# EAGLE schematic v0a (EAGLE 9.3.0)
CREVISION: v0a; DESIGNER: Rafael Silva

## Sheet 1 of 5: Main Controller
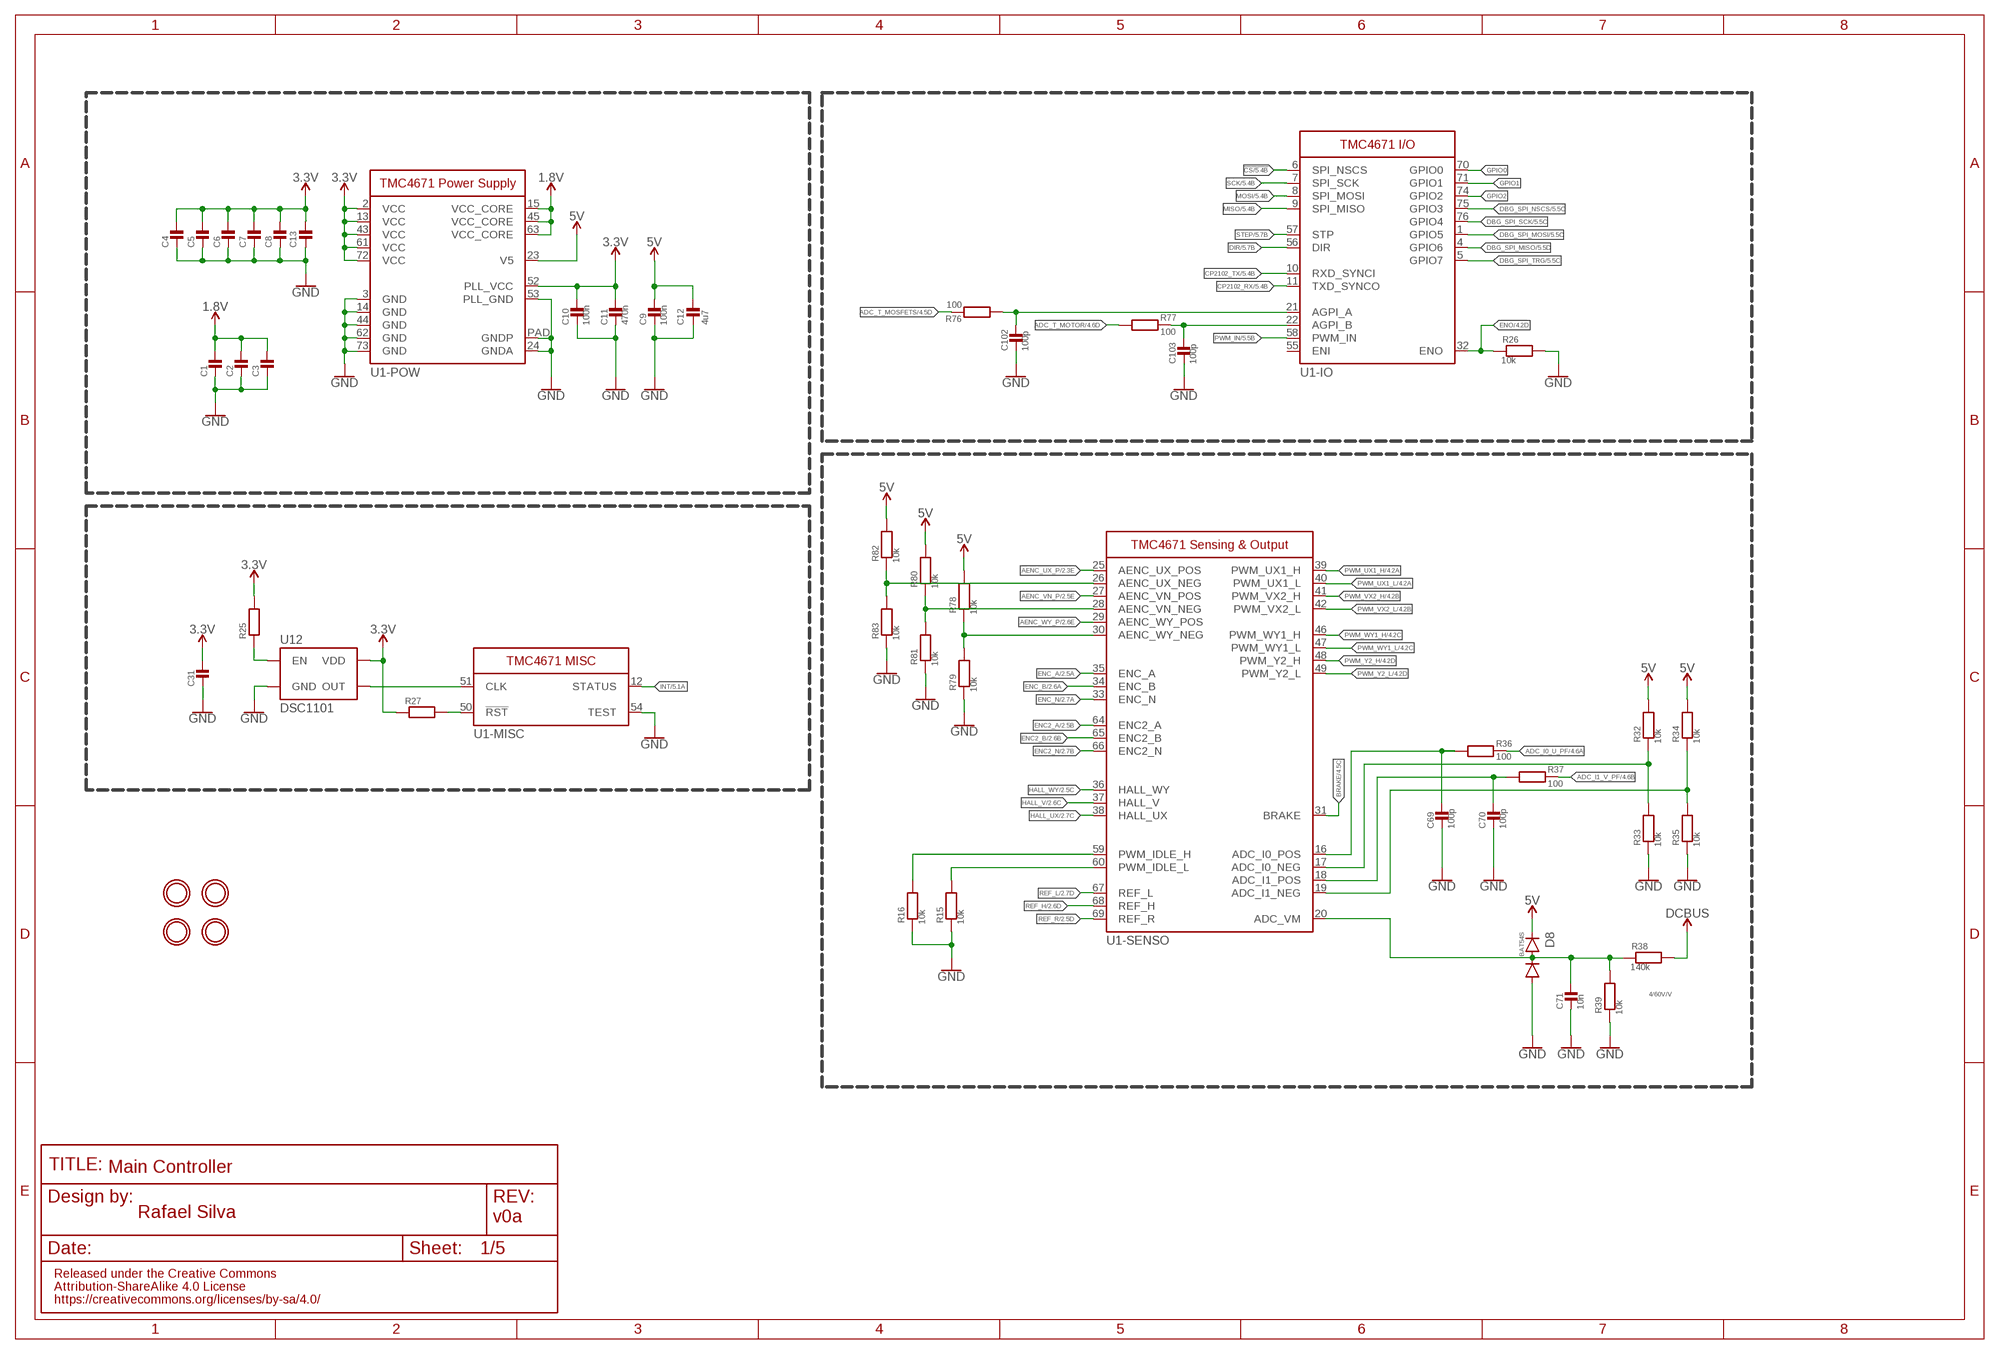
[diagram p0: schematic, sheet 1]

### Parts
C1  MLCC0603  [0603_WAVE]
C2  MLCC0603  [0603_WAVE]
C3  MLCC0603  [0603_WAVE]
C4  MLCC0603  [0603_WAVE]
C5  MLCC0603  [0603_WAVE]
C6  MLCC0603  [0603_WAVE]
C7  MLCC0603  [0603_WAVE]
C8  MLCC0603  [0603_WAVE]
C9  100n  MLCC0603  [0603_WAVE]
C10  100n  MLCC0603  [0603_WAVE]
C11  470n  MLCC0603  [0603_WAVE]
C12  4u7  MLCC0603  [0603_WAVE]
C13  MLCC0603  [0603_WAVE]
C31  MLCC0603  [0603_WAVE]
C69  100p  MLCC0603  [0603_WAVE]
C70  100p  MLCC0603  [0603_WAVE]
C71  10n  MLCC0603  [0603_WAVE]
C102  100p  MLCC0603  [0603_WAVE]
C103  100p  MLCC0603  [0603_WAVE]
D8  BAT54S  [SOT-23-3]
R15  10k  RESISTOR0603  [0603_WAVE]
R16  10k  RESISTOR0603  [0603_WAVE]
R25  RESISTOR0603  [0603_WAVE]
R26  10k  RESISTOR0603  [0603_WAVE]
R27  RESISTOR0603  [0603_WAVE]
R32  10k  RESISTOR0603  [0603_WAVE]
R33  10k  RESISTOR0603  [0603_WAVE]
R34  10k  RESISTOR0603  [0603_WAVE]
R35  10k  RESISTOR0603  [0603_WAVE]
R36  100  RESISTOR0603  [0603_WAVE]
R37  100  RESISTOR0603  [0603_WAVE]
R38  140k  RESISTOR0603  [0603_WAVE]
R39  10k  RESISTOR0603  [0603_WAVE]
R76  100  RESISTOR0603  [0603_WAVE]
R77  100  RESISTOR0603  [0603_WAVE]
R78  10k  RESISTOR0603  [0603_WAVE]
R79  10k  RESISTOR0603  [0603_WAVE]
R80  10k  RESISTOR0603  [0603_WAVE]
R81  10k  RESISTOR0603  [0603_WAVE]
R82  10k  RESISTOR0603  [0603_WAVE]
R83  10k  RESISTOR0603  [0603_WAVE]
U1  TMC4671  [QFN76]
U12  DSC1101  [CDFN_5X3.2]
U$12  MOUNTINGHOLE3.0  [MOUNTINGHOLE_3.0_PLATED]
U$13  MOUNTINGHOLE3.0  [MOUNTINGHOLE_3.0_PLATED]
U$15  MOUNTINGHOLE3.0  [MOUNTINGHOLE_3.0_PLATED]
U$16  MOUNTINGHOLE3.0  [MOUNTINGHOLE_3.0_PLATED]

### Nets
1.8V: C1.P$1 C2.P$1 C3.P$1 U1.15(-POW:VCC_CORE) U1.45(-POW:VCC_CORE) U1.63(-POW:VCC_CORE)
3.3V: C4.P$1 C5.P$1 C6.P$1 C7.P$1 C8.P$1 C10.P$1 C11.P$1 C13.P$1 C31.P$1 R25.P$2 R27.P$1 U1.2(-POW:VCC) U1.13(-POW:VCC) U1.43(-POW:VCC) U1.52(-POW:PLL_VCC) U1.61(-POW:VCC) U1.72(-POW:VCC) U12.6(VDD) ; also sheet 2,3,4,5
5V: C9.P$1 C12.P$1 D8.P$2 R32.P$2 R34.P$2 R78.P$2 R80.P$2 R82.P$2 U1.23(-POW:V5) ; also sheet 2,3,4
!CS: U1.6(-IO:SPI_NSCS) ; also sheet 5
ADC_I0_U_PF: R36.P$2 ; also sheet 4
ADC_I1_V_PF: R37.P$2 ; also sheet 4
ADC_T_MOSFETS: R76.P$2 ; also sheet 4
ADC_T_MOTOR: R77.P$1 ; also sheet 4
AENC_UX_P: U1.25(-SENSO:AENC_UX_POS) ; also sheet 2
AENC_VN_P: U1.27(-SENSO:AENC_VN_POS) ; also sheet 2
AENC_WY_P: U1.29(-SENSO:AENC_WY_POS) ; also sheet 2
BRAKE: U1.31(-SENSO:BRAKE) ; also sheet 4
CP2102_RX: U1.11(-IO:TXD_SYNCO) ; also sheet 5
CP2102_TX: U1.10(-IO:RXD_SYNCI) ; also sheet 5
DBG_SPI_MISO: U1.4(-IO:GPIO6) ; also sheet 5
DBG_SPI_MOSI: U1.1(-IO:GPIO5) ; also sheet 5
DBG_SPI_NSCS: U1.75(-IO:GPIO3) ; also sheet 5
DBG_SPI_SCK: U1.76(-IO:GPIO4) ; also sheet 5
DBG_SPI_TRG: U1.5(-IO:GPIO7) ; also sheet 5
DCBUS: R38.P$2 ; also sheet 3,4
DIR: U1.56(-IO:DIR) ; also sheet 5
ENC2_A: U1.64(-SENSO:ENC2_A) ; also sheet 2
ENC2_B: U1.65(-SENSO:ENC2_B) ; also sheet 2
ENC2_N: U1.66(-SENSO:ENC2_N) ; also sheet 2
ENC_A: U1.35(-SENSO:ENC_A) ; also sheet 2
ENC_B: U1.34(-SENSO:ENC_B) ; also sheet 2
ENC_N: U1.33(-SENSO:ENC_N) ; also sheet 2
ENO: R26.P$1 U1.32(-IO:ENO) ; also sheet 4
GND: C1.P$2 C2.P$2 C3.P$2 C4.P$2 C5.P$2 C6.P$2 C7.P$2 C8.P$2 C9.P$2 C10.P$2 C11.P$2 C12.P$2 C13.P$2 C31.P$2 C69.P$2 C70.P$2 C71.P$2 C102.P$2 C103.P$2 D8.P$1 R15.P$1 R16.P$1 R26.P$2 R33.P$1 R35.P$1 R39.P$1 R79.P$1 R81.P$1 R83.P$1 U1.3(-POW:GND) U1.14(-POW:GND) U1.24(-POW:GNDA) U1.44(-POW:GND) U1.53(-POW:PLL_GND) U1.54(-MISC:TEST) U1.62(-POW:GND) U1.73(-POW:GND) U1.PAD(-POW:GNDP) U12.3(GND) ; also sheet 2,3,4,5
GPIO0: U1.70(-IO:GPIO0)
GPIO1: U1.71(-IO:GPIO1)
GPIO2: U1.74(-IO:GPIO2)
HALL_UX: U1.38(-SENSO:HALL_UX) ; also sheet 2
HALL_V: U1.37(-SENSO:HALL_V) ; also sheet 2
HALL_WY: U1.36(-SENSO:HALL_WY) ; also sheet 2
INT: U1.12(-MISC:STATUS) ; also sheet 5
MISO: U1.9(-IO:SPI_MISO) ; also sheet 5
MOSI: U1.8(-IO:SPI_MOSI) ; also sheet 5
N$38: R15.P$2 U1.60(-SENSO:PWM_IDLE_L)
N$39: R16.P$2 U1.59(-SENSO:PWM_IDLE_H)
N$41: U1.51(-MISC:CLK) U12.4(OUT)
N$42: R27.P$2 U1.50(-MISC:!RST!)
N$44: R25.P$1 U12.1(EN)
N$50: C69.P$1 R36.P$1 U1.16(-SENSO:ADC_I0_POS)
N$51: C70.P$1 R37.P$1 U1.18(-SENSO:ADC_I1_POS)
N$52: R32.P$1 R33.P$2 U1.17(-SENSO:ADC_I0_NEG)
N$53: R34.P$1 R35.P$2 U1.19(-SENSO:ADC_I1_NEG)
N$54: C71.P$1 D8.P$3 R38.P$1 R39.P$2 U1.20(-SENSO:ADC_VM)
N$92: C102.P$1 R76.P$1 U1.21(-IO:AGPI_A)
N$93: C103.P$1 R77.P$2 U1.22(-IO:AGPI_B)
N$94: R78.P$1 R79.P$2 U1.30(-SENSO:AENC_WY_NEG)
N$95: R80.P$1 R81.P$2 U1.28(-SENSO:AENC_VN_NEG)
N$96: R82.P$1 R83.P$2 U1.26(-SENSO:AENC_UX_NEG)
PWM_IN: U1.58(-IO:PWM_IN) ; also sheet 5
PWM_UX1_H: U1.39(-SENSO:PWM_UX1_H) ; also sheet 4
PWM_UX1_L: U1.40(-SENSO:PWM_UX1_L) ; also sheet 4
PWM_VX2_H: U1.41(-SENSO:PWM_VX2_H) ; also sheet 4
PWM_VX2_L: U1.42(-SENSO:PWM_VX2_L) ; also sheet 4
PWM_WY1_H: U1.46(-SENSO:PWM_WY1_H) ; also sheet 4
PWM_WY1_L: U1.47(-SENSO:PWM_WY1_L) ; also sheet 4
PWM_Y2_H: U1.48(-SENSO:PWM_Y2_H) ; also sheet 4
PWM_Y2_L: U1.49(-SENSO:PWM_Y2_L) ; also sheet 4
REF_H: U1.68(-SENSO:REF_H) ; also sheet 2
REF_L: U1.67(-SENSO:REF_L) ; also sheet 2
REF_R: U1.69(-SENSO:REF_R) ; also sheet 2
SCK: U1.7(-IO:SPI_SCK) ; also sheet 5
STEP: U1.57(-IO:STP) ; also sheet 5
Unconnected: U1.55(-IO:ENI)

### Notes on the sheet
- 4/60V/V
- Main Controller

## Sheet 2 of 5: Feedback
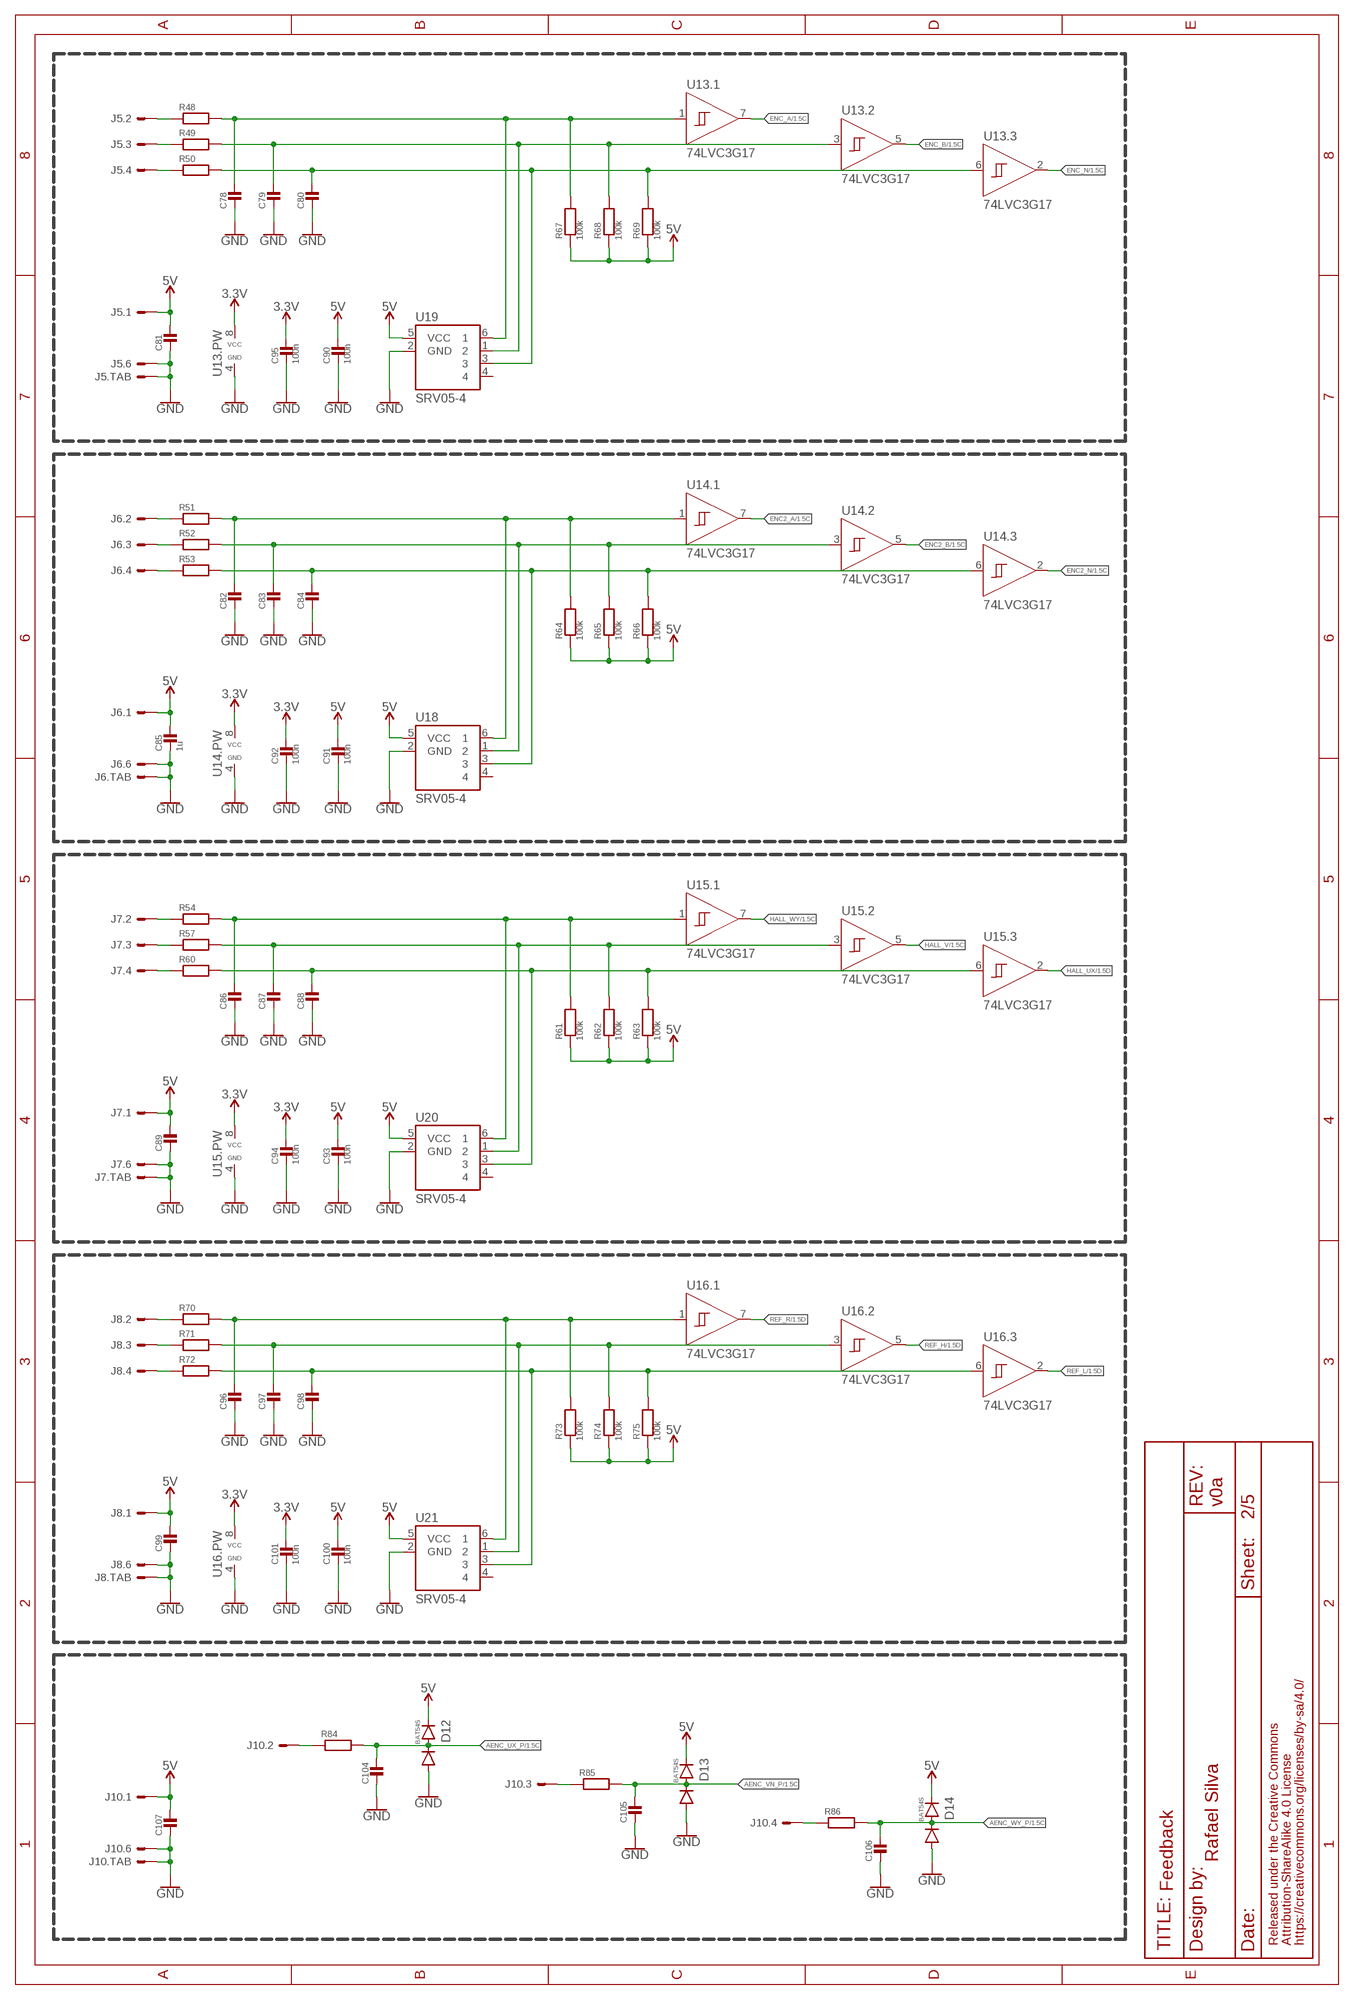
[diagram p1: schematic, sheet 2]

### Parts
C78  MLCC0603  [0603_WAVE]
C79  MLCC0603  [0603_WAVE]
C80  MLCC0603  [0603_WAVE]
C81  MLCC0603  [0603_WAVE]
C82  MLCC0603  [0603_WAVE]
C83  MLCC0603  [0603_WAVE]
C84  MLCC0603  [0603_WAVE]
C85  1u  MLCC0603  [0603_WAVE]
C86  MLCC0603  [0603_WAVE]
C87  MLCC0603  [0603_WAVE]
C88  MLCC0603  [0603_WAVE]
C89  MLCC0603  [0603_WAVE]
C90  100n  MLCC0603  [0603_WAVE]
C91  100n  MLCC0603  [0603_WAVE]
C92  100n  MLCC0603  [0603_WAVE]
C93  100n  MLCC0603  [0603_WAVE]
C94  100n  MLCC0603  [0603_WAVE]
C95  100n  MLCC0603  [0603_WAVE]
C96  MLCC0603  [0603_WAVE]
C97  MLCC0603  [0603_WAVE]
C98  MLCC0603  [0603_WAVE]
C99  MLCC0603  [0603_WAVE]
C100  100n  MLCC0603  [0603_WAVE]
C101  100n  MLCC0603  [0603_WAVE]
C104  MLCC0603  [0603_WAVE]
C105  MLCC0603  [0603_WAVE]
C106  MLCC0603  [0603_WAVE]
C107  MLCC0603  [0603_WAVE]
D12  BAT54S  [SOT-23-3]
D13  BAT54S  [SOT-23-3]
D14  BAT54S  [SOT-23-3]
J5  SH-5  [SM05B-SSR-H-TB]
J6  SH-5  [SM05B-SSR-H-TB]
J7  SH-5  [SM05B-SSR-H-TB]
J8  SH-5  [SM05B-SSR-H-TB]
J10  SH-5  [SM05B-SSR-H-TB]
R48  RESISTOR0603  [0603_WAVE]
R49  RESISTOR0603  [0603_WAVE]
R50  RESISTOR0603  [0603_WAVE]
R51  RESISTOR0603  [0603_WAVE]
R52  RESISTOR0603  [0603_WAVE]
R53  RESISTOR0603  [0603_WAVE]
R54  RESISTOR0603  [0603_WAVE]
R57  RESISTOR0603  [0603_WAVE]
R60  RESISTOR0603  [0603_WAVE]
R61  100k  RESISTOR0603  [0603_WAVE]
R62  100k  RESISTOR0603  [0603_WAVE]
R63  100k  RESISTOR0603  [0603_WAVE]
R64  100k  RESISTOR0603  [0603_WAVE]
R65  100k  RESISTOR0603  [0603_WAVE]
R66  100k  RESISTOR0603  [0603_WAVE]
R67  100k  RESISTOR0603  [0603_WAVE]
R68  100k  RESISTOR0603  [0603_WAVE]
R69  100k  RESISTOR0603  [0603_WAVE]
R70  RESISTOR0603  [0603_WAVE]
R71  RESISTOR0603  [0603_WAVE]
R72  RESISTOR0603  [0603_WAVE]
R73  100k  RESISTOR0603  [0603_WAVE]
R74  100k  RESISTOR0603  [0603_WAVE]
R75  100k  RESISTOR0603  [0603_WAVE]
R84  RESISTOR0603  [0603_WAVE]
R85  RESISTOR0603  [0603_WAVE]
R86  RESISTOR0603  [0603_WAVE]
U13  74LVC3G17  [TSSOP-8]
U14  74LVC3G17  [TSSOP-8]
U15  74LVC3G17  [TSSOP-8]
U16  74LVC3G17  [TSSOP-8]
U18  SRV05-4  [SOT23-6]
U19  SRV05-4  [SOT23-6]
U20  SRV05-4  [SOT23-6]
U21  SRV05-4  [SOT23-6]

### Nets
3.3V: C92.P$1 C94.P$1 C95.P$1 C101.P$1 U13.8(.PW:VCC) U14.8(.PW:VCC) U15.8(.PW:VCC) U16.8(.PW:VCC) ; also sheet 1,3,4,5
5V: C81.P$1 C85.P$1 C89.P$1 C90.P$1 C91.P$1 C93.P$1 C99.P$1 C100.P$1 C107.P$1 D12.P$2 D13.P$2 D14.P$2 J5.1 J6.1 J7.1 J8.1 J10.1 R61.P$1 R62.P$1 R63.P$1 R64.P$1 R65.P$1 R66.P$1 R67.P$1 R68.P$1 R69.P$1 R73.P$1 R74.P$1 R75.P$1 U18.5(VCC) U19.5(VCC) U20.5(VCC) U21.5(VCC) ; also sheet 1,3,4
AENC_UX_P: C104.P$1 D12.P$3 R84.P$2 ; also sheet 1
AENC_VN_P: C105.P$1 D13.P$3 R85.P$2 ; also sheet 1
AENC_WY_P: C106.P$1 D14.P$3 R86.P$2 ; also sheet 1
ENC2_A: U14.7(.1:Y) ; also sheet 1
ENC2_B: U14.5(.2:Y) ; also sheet 1
ENC2_N: U14.2(.3:Y) ; also sheet 1
ENC_A: U13.7(.1:Y) ; also sheet 1
ENC_B: U13.5(.2:Y) ; also sheet 1
ENC_N: U13.2(.3:Y) ; also sheet 1
GND: C78.P$2 C79.P$2 C80.P$2 C81.P$2 C82.P$2 C83.P$2 C84.P$2 C85.P$2 C86.P$2 C87.P$2 C88.P$2 C89.P$2 C90.P$2 C91.P$2 C92.P$2 C93.P$2 C94.P$2 C95.P$2 C96.P$2 C97.P$2 C98.P$2 C99.P$2 C100.P$2 C101.P$2 C104.P$2 C105.P$2 C106.P$2 C107.P$2 D12.P$1 D13.P$1 D14.P$1 J5.5 J5.FIT@1 J5.FIT@2 J6.5 J6.FIT@1 J6.FIT@2 J7.5 J7.FIT@1 J7.FIT@2 J8.5 J8.FIT@1 J8.FIT@2 J10.5 J10.FIT@1 J10.FIT@2 U13.4(.PW:GND) U14.4(.PW:GND) U15.4(.PW:GND) U16.4(.PW:GND) U18.2(GND) U19.2(GND) U20.2(GND) U21.2(GND) ; also sheet 1,3,4,5
HALL_UX: U15.2(.3:Y) ; also sheet 1
HALL_V: U15.5(.2:Y) ; also sheet 1
HALL_WY: U15.7(.1:Y) ; also sheet 1
N$67: C80.P$1 R50.P$2 R69.P$2 U13.6(.3:A) U19.3
N$69: C79.P$1 R49.P$2 R68.P$2 U13.3(.2:A) U19.1
N$70: C84.P$1 R53.P$2 R66.P$2 U14.6(.3:A) U18.3
N$71: J5.2 R48.P$1
N$72: J5.3 R49.P$1
N$73: J5.4 R50.P$1
N$74: C78.P$1 R48.P$2 R67.P$2 U13.1(.1:A) U19.6
N$75: C83.P$1 R52.P$2 R65.P$2 U14.3(.2:A) U18.1
N$76: J6.2 R51.P$1
N$77: J6.3 R52.P$1
N$78: J6.4 R53.P$1
N$79: C82.P$1 R51.P$2 R64.P$2 U14.1(.1:A) U18.6
N$80: C88.P$1 R60.P$2 R63.P$2 U15.6(.3:A) U20.3
N$81: C87.P$1 R57.P$2 R62.P$2 U15.3(.2:A) U20.1
N$82: J7.2 R54.P$1
N$83: J7.3 R57.P$1
N$84: J7.4 R60.P$1
N$85: C86.P$1 R54.P$2 R61.P$2 U15.1(.1:A) U20.6
N$86: C98.P$1 R72.P$2 R75.P$2 U16.6(.3:A) U21.3
N$87: C97.P$1 R71.P$2 R74.P$2 U16.3(.2:A) U21.1
N$88: J8.2 R70.P$1
N$89: J8.3 R71.P$1
N$90: J8.4 R72.P$1
N$91: C96.P$1 R70.P$2 R73.P$2 U16.1(.1:A) U21.6
N$97: J10.4 R86.P$1
N$98: J10.3 R85.P$1
N$99: J10.2 R84.P$1
REF_H: U16.5(.2:Y) ; also sheet 1
REF_L: U16.2(.3:Y) ; also sheet 1
REF_R: U16.7(.1:Y) ; also sheet 1
Unconnected: U18.4 U19.4 U20.4 U21.4

### Notes on the sheet
- Feedback

## Sheet 3 of 5: Power Management
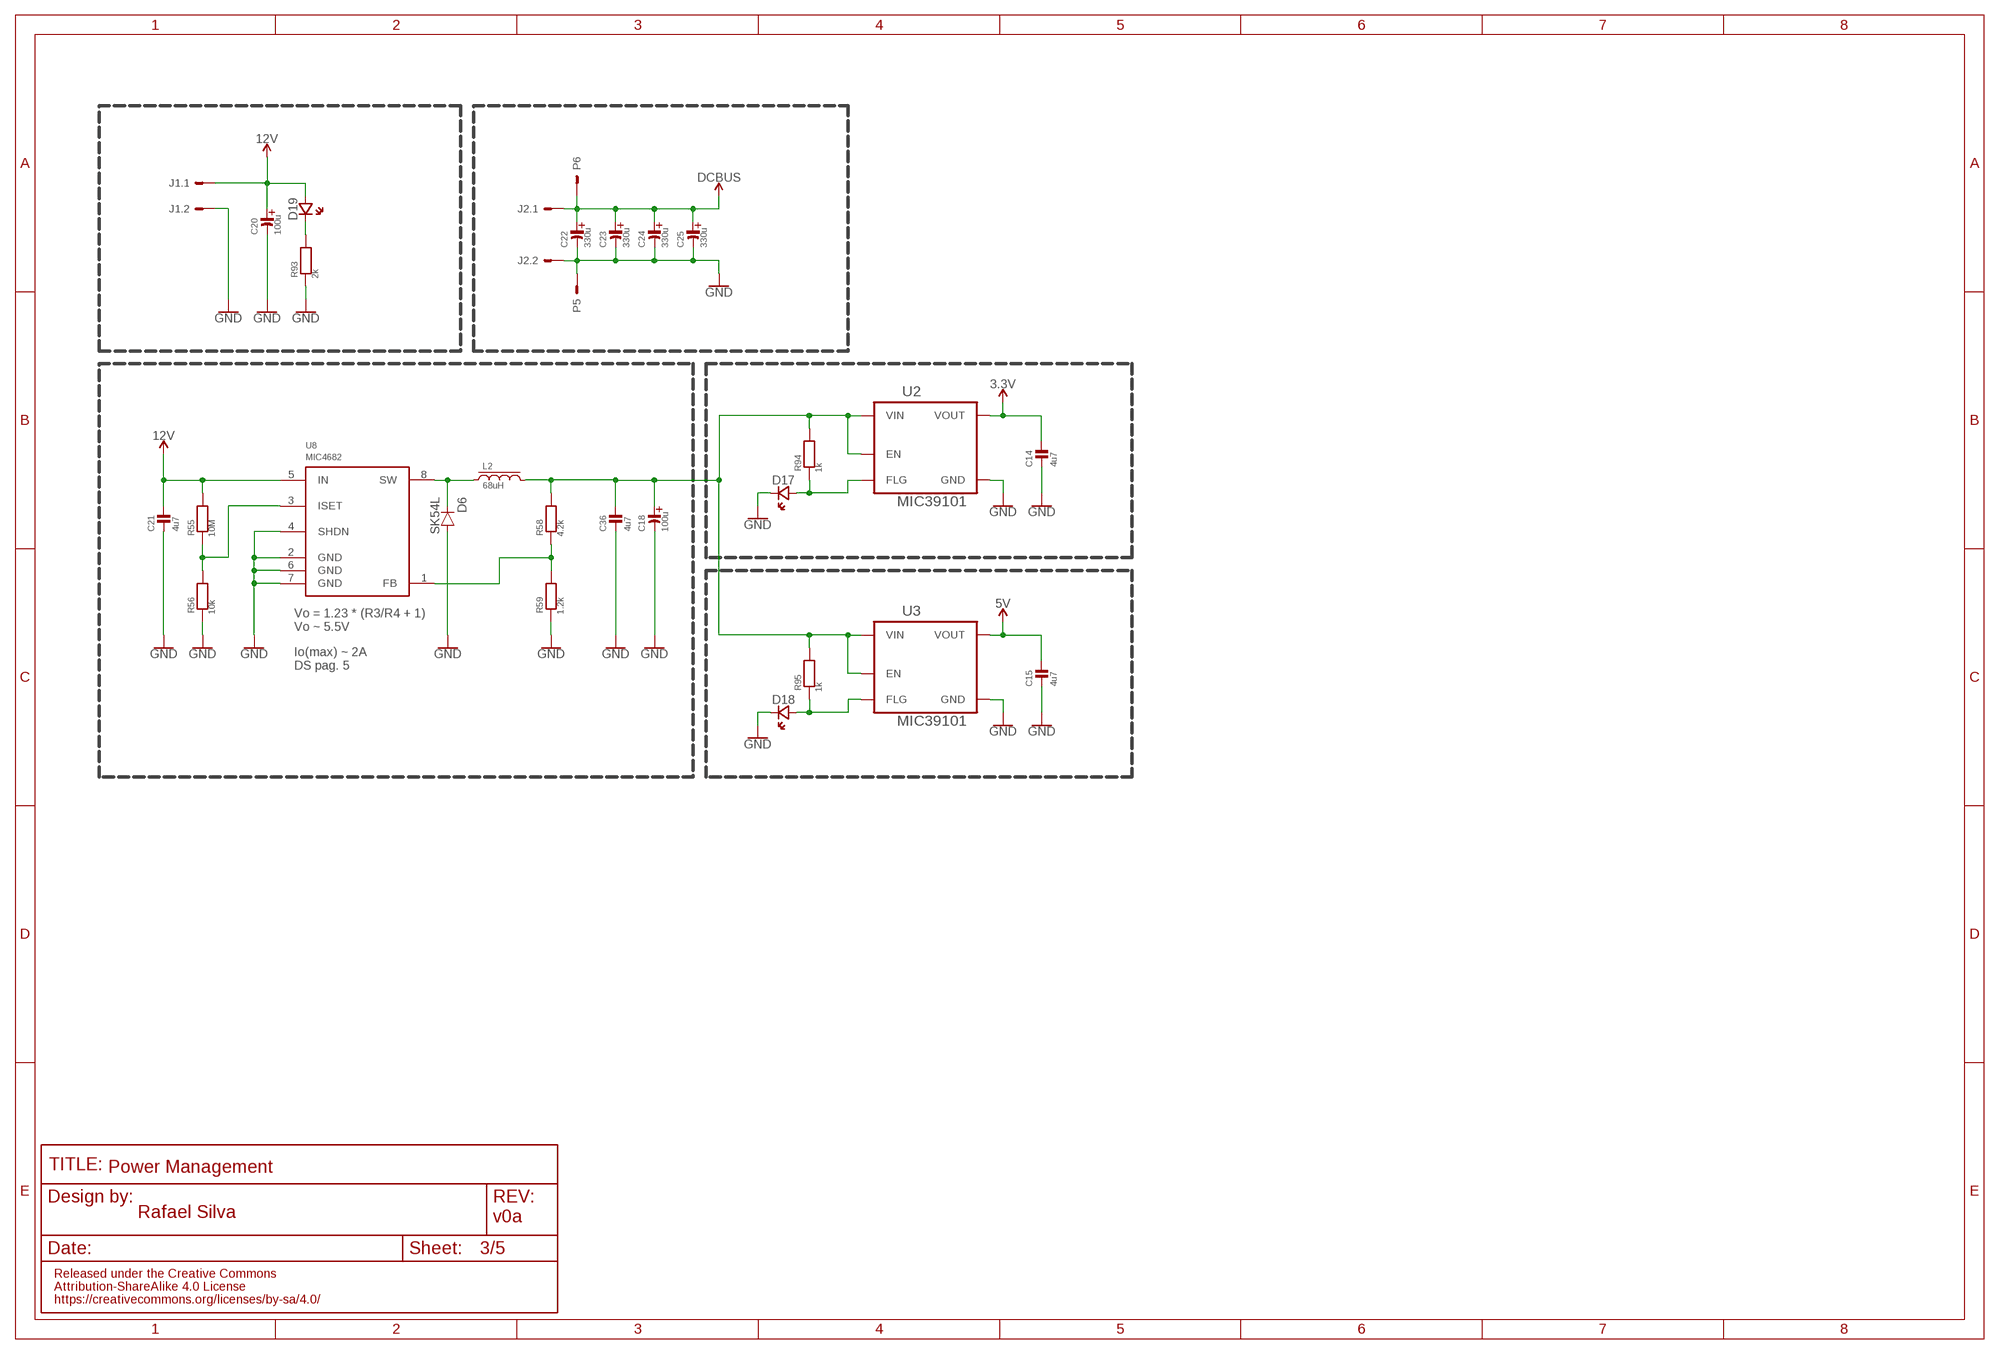
[diagram p2: schematic, sheet 3]

### Parts
C14  4u7  MLCC0603  [0603_WAVE]
C15  4u7  MLCC0603  [0603_WAVE]
C18  100u  CAPACITOR_ELD  [PANASONIC_D]
C20  100u  CAPACITOR_ELD  [PANASONIC_D]
C21  4u7  MLCC0603  [0603_WAVE]
C22  330u  CAPACITOR_ELG  [PANASONIC_G]
C23  330u  CAPACITOR_ELG  [PANASONIC_G]
C24  330u  CAPACITOR_ELG  [PANASONIC_G]
C25  330u  CAPACITOR_ELG  [PANASONIC_G]
C36  4u7  MLCC0603  [0603_WAVE]
D6  SK54L  [DO214AA]
D17  LED0603  [CHIPLED_0603]
D18  LED0603  [CHIPLED_0603]
D19  LED0603  [CHIPLED_0603]
J1  2P-6.35P  [2P-6.35P]
J2  2P-6.35P  [2P-6.35P]
L2  68uH  INDUCTORCDRH104R  [CDRH104R]
P5  POWPAD  [TH-HP]
P6  POWPAD  [TH-HP]
R55  10M  RESISTOR0603  [0603_WAVE]
R56  10k  RESISTOR0603  [0603_WAVE]
R58  4.2k  RESISTOR0603  [0603_WAVE]
R59  1.2k  RESISTOR0603  [0603_WAVE]
R93  2k  RESISTOR0603  [0603_WAVE]
R94  1k  RESISTOR0603  [0603_WAVE]
R95  1k  RESISTOR0603  [0603_WAVE]
U2  MIC39101  [SOIC8]
U3  MIC39101  [SOIC8]
U8  MIC4682  [SOIC8]

### Nets
3.3V: C14.P$1 U2.3(VOUT) ; also sheet 1,2,4,5
5V: C15.P$1 U3.3(VOUT) ; also sheet 1,2,4
12V: C20.+(AN) C21.P$1 D19.A(AN) J1.1 R55.P$2 U8.5(IN) ; also sheet 4
DCBUS: C22.+(AN) C23.+(AN) C24.+(AN) C25.+(AN) J2.1 P6.H1(S) P6.H2(S) P6.H3(S) P6.H4(S) P6.H5(S) P6.H6(S) P6.H7(S) P6.H8(S) P6.H9(S) P6.H10(S) P6.H11(S) P6.H12(S) P6.PAD(S) ; also sheet 1,4
GND: C14.P$2 C15.P$2 C18.-(CA) C20.-(CA) C21.P$2 C22.-(CA) C23.-(CA) C24.-(CA) C25.-(CA) C36.P$2 D6.A D17.C(CA) D18.C(CA) J1.2 J2.2 P5.H1(S) P5.H2(S) P5.H3(S) P5.H4(S) P5.H5(S) P5.H6(S) P5.H7(S) P5.H8(S) P5.H9(S) P5.H10(S) P5.H11(S) P5.H12(S) P5.PAD(S) R56.P$1 R59.P$1 R93.P$1 U2.5(GND) U2.6(GND) U2.7(GND) U2.8(GND) U3.5(GND) U3.6(GND) U3.7(GND) U3.8(GND) U8.2(GND) U8.4(SHDN) U8.6(GND) U8.7(GND) ; also sheet 1,2,4,5
N$5: C18.+(AN) C36.P$1 L2.2 R58.P$2 R94.P$2 R95.P$2 U2.1(EN) U2.2(VIN) U3.1(EN) U3.2(VIN)
N$45: D6.C L2.1 U8.8(SW)
N$46: R58.P$1 R59.P$2 U8.1(FB)
N$47: R55.P$1 R56.P$2 U8.3(ISET)
N$60: D17.A(AN) R94.P$1 U2.4(FLG)
N$62: D19.C(CA) R93.P$2
N$104: D18.A(AN) R95.P$1 U3.4(FLG)

### Notes on the sheet
- Vo = 1.23 * (R3/R4 + 1)
  Vo ~ 5.5V
- Io(max) ~ 2A
  DS pag. 5
- Power Management

## Sheet 4 of 5: Power Stage
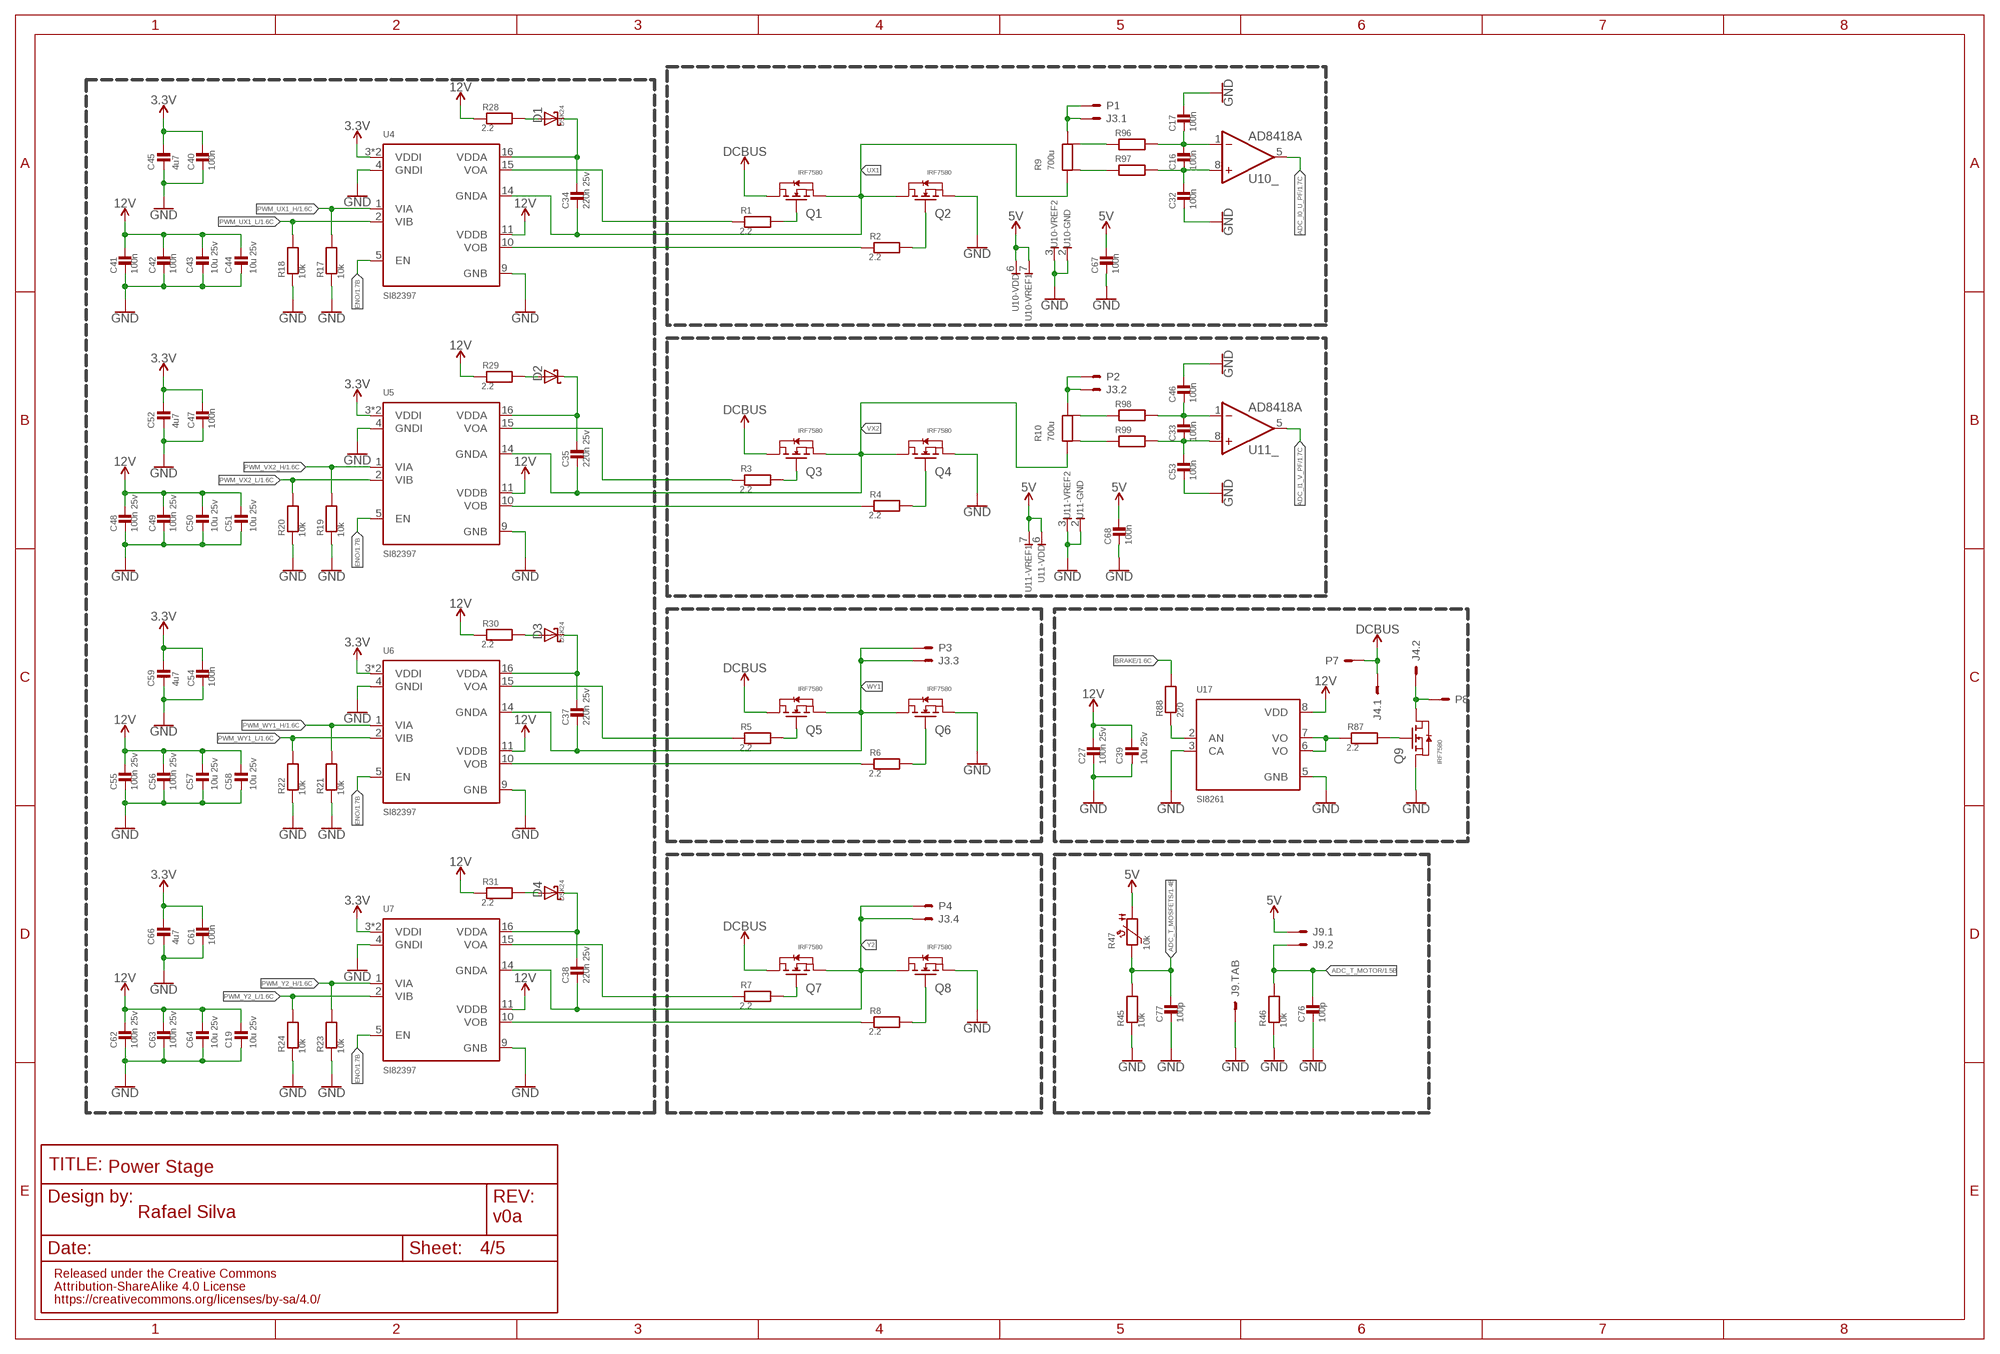
[diagram p3: schematic, sheet 4]

### Parts
C16  100n  MLCC0603  [0603_WAVE]
C17  100n  MLCC0603  [0603_WAVE]
C19  10u 25v  MLCC0603  [0603_WAVE]
C27  100n 25v  MLCC0603  [0603_WAVE]
C32  100n  MLCC0603  [0603_WAVE]
C33  100n  MLCC0603  [0603_WAVE]
C34  220n 25v  MLCC0603  [0603_WAVE]
C35  220n 25v  MLCC0603  [0603_WAVE]
C37  220n 25v  MLCC0603  [0603_WAVE]
C38  220n 25v  MLCC0603  [0603_WAVE]
C39  10u 25v  MLCC0603  [0603_WAVE]
C40  100n  MLCC0603  [0603_WAVE]
C41  100n  MLCC0603  [0603_WAVE]
C42  100n  MLCC0603  [0603_WAVE]
C43  10u 25v  MLCC0603  [0603_WAVE]
C44  10u 25v  MLCC0603  [0603_WAVE]
C45  4u7  MLCC0603  [0603_WAVE]
C46  100n  MLCC0603  [0603_WAVE]
C47  100n  MLCC0603  [0603_WAVE]
C48  100n 25v  MLCC0603  [0603_WAVE]
C49  100n 25v  MLCC0603  [0603_WAVE]
C50  10u 25v  MLCC0603  [0603_WAVE]
C51  10u 25v  MLCC0603  [0603_WAVE]
C52  4u7  MLCC0603  [0603_WAVE]
C53  100n  MLCC0603  [0603_WAVE]
C54  100n  MLCC0603  [0603_WAVE]
C55  100n 25v  MLCC0603  [0603_WAVE]
C56  100n 25v  MLCC0603  [0603_WAVE]
C57  10u 25v  MLCC0603  [0603_WAVE]
C58  10u 25v  MLCC0603  [0603_WAVE]
C59  4u7  MLCC0603  [0603_WAVE]
C61  100n  MLCC0603  [0603_WAVE]
C62  100n 25v  MLCC0603  [0603_WAVE]
C63  100n 25v  MLCC0603  [0603_WAVE]
C64  10u 25v  MLCC0603  [0603_WAVE]
C66  4u7  MLCC0603  [0603_WAVE]
C67  100n  MLCC0603  [0603_WAVE]
C68  100n  MLCC0603  [0603_WAVE]
C76  100p  MLCC0603  [0603_WAVE]
C77  100p  MLCC0603  [0603_WAVE]
D1  DSK24  [SOD-123]
D2  DSK24  [SOD-123]
D3  DSK24  [SOD-123]
D4  DSK24  [SOD-123]
J3  4P-6.35P  [4P-6.35P]
J4  2P-6.35P  [2P-6.35P]
J9  SH-2  [SM02B-SSR-H-TB]
P1  POWPAD  [TH-HP]
P2  POWPAD  [TH-HP]
P3  POWPAD  [TH-HP]
P4  POWPAD  [TH-HP]
P7  POWPAD  [TH-HP]
P8  POWPAD  [TH-HP]
Q1  IRF7580  [DIRECTFET-ME]
Q2  IRF7580  [DIRECTFET-ME]
Q3  IRF7580  [DIRECTFET-ME]
Q4  IRF7580  [DIRECTFET-ME]
Q5  IRF7580  [DIRECTFET-ME]
Q6  IRF7580  [DIRECTFET-ME]
Q7  IRF7580  [DIRECTFET-ME]
Q8  IRF7580  [DIRECTFET-ME]
Q9  IRF7580  [DIRECTFET-ME]
R1  2.2  RESISTOR0603  [0603_WAVE]
R2  2.2  RESISTOR0603  [0603_WAVE]
R3  2.2  RESISTOR0603  [0603_WAVE]
R4  2.2  RESISTOR0603  [0603_WAVE]
R5  2.2  RESISTOR0603  [0603_WAVE]
R6  2.2  RESISTOR0603  [0603_WAVE]
R7  2.2  RESISTOR0603  [0603_WAVE]
R8  2.2  RESISTOR0603  [0603_WAVE]
R9  700u  LRMAP3920  [3920]
R10  700u  LRMAP3920  [3920]
R17  10k  RESISTOR0603  [0603_WAVE]
R18  10k  RESISTOR0603  [0603_WAVE]
R19  10k  RESISTOR0603  [0603_WAVE]
R20  10k  RESISTOR0603  [0603_WAVE]
R21  10k  RESISTOR0603  [0603_WAVE]
R22  10k  RESISTOR0603  [0603_WAVE]
R23  10k  RESISTOR0603  [0603_WAVE]
R24  10k  RESISTOR0603  [0603_WAVE]
R28  2.2  RESISTOR0603  [0603_WAVE]
R29  2.2  RESISTOR0603  [0603_WAVE]
R30  2.2  RESISTOR0603  [0603_WAVE]
R31  2.2  RESISTOR0603  [0603_WAVE]
R45  10k  RESISTOR0603  [0603_WAVE]
R46  10k  RESISTOR0603  [0603_WAVE]
R47  10k  NTC0603  [0603_WAVE]
R87  2.2  RESISTOR0603  [0603_WAVE]
R88  220  RESISTOR0603  [0603_WAVE]
R96  RESISTOR0603  [0603_WAVE]
R97  RESISTOR0603  [0603_WAVE]
R98  RESISTOR0603  [0603_WAVE]
R99  RESISTOR0603  [0603_WAVE]
U4  SI82397  [SOIC-16-WB]
U5  SI82397  [SOIC-16-WB]
U6  SI82397  [SOIC-16-WB]
U7  SI82397  [SOIC-16-WB]
U10  AD8418A  [MSOP-8]
U11  AD8418A  [MSOP-8]
U17  SI8261  [SOIC_8]

### Nets
3.3V: C40.P$1 C45.P$1 C47.P$1 C52.P$1 C54.P$1 C59.P$1 C61.P$1 C66.P$1 U4.3(VDDI) U4.8(VDDI) U5.3(VDDI) U5.8(VDDI) U6.3(VDDI) U6.8(VDDI) U7.3(VDDI) U7.8(VDDI) ; also sheet 1,2,3,5
5V: C67.P$1 C68.P$1 J9.1 R47.P$2 U10.6 U10.7 U11.6 U11.7 ; also sheet 1,2,3
12V: C19.P$1 C27.P$1 C39.P$1 C41.P$1 C42.P$1 C43.P$1 C44.P$1 C48.P$1 C49.P$1 C50.P$1 C51.P$1 C55.P$1 C56.P$1 C57.P$1 C58.P$1 C62.P$1 C63.P$1 C64.P$1 R28.P$1 R29.P$1 R30.P$1 R31.P$1 U4.11(VDDB) U5.11(VDDB) U6.11(VDDB) U7.11(VDDB) U17.8(VDD) ; also sheet 3
ADC_I0_U_PF: U10.5(_:O) ; also sheet 1
ADC_I1_V_PF: U11.5(_:O) ; also sheet 1
ADC_T_MOSFETS: C77.P$1 R45.P$2 R47.P$1 ; also sheet 1
ADC_T_MOTOR: C76.P$1 J9.2 R46.P$2 ; also sheet 1
BRAKE: R88.P$2 ; also sheet 1
DCBUS: J4.1 P7.H1(S) P7.H2(S) P7.H3(S) P7.H4(S) P7.H5(S) P7.H6(S) P7.H7(S) P7.H8(S) P7.H9(S) P7.H10(S) P7.H11(S) P7.H12(S) P7.PAD(S) Q1.D1 Q1.D2(D1) Q1.D3(D1) Q1.D4(D1) Q3.D1 Q3.D2(D1) Q3.D3(D1) Q3.D4(D1) Q5.D1 Q5.D2(D1) Q5.D3(D1) Q5.D4(D1) Q7.D1 Q7.D2(D1) Q7.D3(D1) Q7.D4(D1) ; also sheet 1,3
ENO: U4.5(EN) U5.5(EN) U6.5(EN) U7.5(EN) ; also sheet 1
GND: C17.P$1 C19.P$2 C27.P$2 C32.P$2 C39.P$2 C40.P$2 C41.P$2 C42.P$2 C43.P$2 C44.P$2 C45.P$2 C46.P$1 C47.P$2 C48.P$2 C49.P$2 C50.P$2 C51.P$2 C52.P$2 C53.P$2 C54.P$2 C55.P$2 C56.P$2 C57.P$2 C58.P$2 C59.P$2 C61.P$2 C62.P$2 C63.P$2 C64.P$2 C66.P$2 C67.P$2 C68.P$2 C76.P$2 C77.P$2 J9.FIT@1 J9.FIT@2 Q2.S1 Q2.S2(S1) Q2.S3(S1) Q2.S4(S1) Q2.S5(S1) Q4.S1 Q4.S2(S1) Q4.S3(S1) Q4.S4(S1) Q4.S5(S1) Q6.S1 Q6.S2(S1) Q6.S3(S1) Q6.S4(S1) Q6.S5(S1) Q8.S1 Q8.S2(S1) Q8.S3(S1) Q8.S4(S1) Q8.S5(S1) Q9.S1 Q9.S2(S1) Q9.S3(S1) Q9.S4(S1) Q9.S5(S1) R17.P$1 R18.P$1 R19.P$1 R20.P$1 R21.P$1 R22.P$1 R23.P$1 R24.P$1 R45.P$1 R46.P$1 U4.4(GNDI) U4.9(GNB) U5.4(GNDI) U5.9(GNB) U6.4(GNDI) U6.9(GNB) U7.4(GNDI) U7.9(GNB) U10.2 U10.3 U11.2 U11.3 U17.3(CA) U17.5(GNB) ; also sheet 1,2,3,5
N$3: R1.P$1 U4.15(VOA)
N$4: Q2.G(G1) R2.P$2
N$6: R9.SENSE+ R97.P$1
N$7: C34.P$1 D1.C U4.16(VDDA)
N$8: R3.P$1 U5.15(VOA)
N$9: Q4.G(G1) R4.P$2
N$10: R9.SENSE- R96.P$1
N$11: C35.P$1 D2.C U5.16(VDDA)
N$12: R5.P$1 U6.15(VOA)
N$13: Q6.G(G1) R6.P$2
N$14: C16.P$1 C17.P$2 R96.P$2 U10.1(_:IN-)
N$15: C37.P$1 D3.C U6.16(VDDA)
N$16: R7.P$1 U7.15(VOA)
N$17: Q8.G(G1) R8.P$2
N$18: C16.P$2 C32.P$1 R97.P$2 U10.8(_:IN+)
N$19: C38.P$1 D4.C U7.16(VDDA)
N$20: Q5.G(G1) R5.P$2
N$21: Q1.G(G1) R1.P$2
N$22: Q3.G(G1) R3.P$2
N$23: Q7.G(G1) R7.P$2
N$24: R2.P$1 U4.10(VOB)
N$25: R4.P$1 U5.10(VOB)
N$26: R6.P$1 U6.10(VOB)
N$27: R8.P$1 U7.10(VOB)
N$28: J3.2 P2.H1(S) P2.H2(S) P2.H3(S) P2.H4(S) P2.H5(S) P2.H6(S) P2.H7(S) P2.H8(S) P2.H9(S) P2.H10(S) P2.H11(S) P2.H12(S) P2.PAD(S) R10.3 R10.4
N$29: J3.1 P1.H1(S) P1.H2(S) P1.H3(S) P1.H4(S) P1.H5(S) P1.H6(S) P1.H7(S) P1.H8(S) P1.H9(S) P1.H10(S) P1.H11(S) P1.H12(S) P1.PAD(S) R9.3 R9.4
N$40: D4.A R31.P$2
N$43: D3.A R30.P$2
N$48: D2.A R29.P$2
N$49: D1.A R28.P$2
N$55: R10.SENSE- R98.P$1
N$56: R10.SENSE+ R99.P$1
N$57: C33.P$2 C53.P$1 R99.P$2 U11.8(_:IN+)
N$58: C33.P$1 C46.P$2 R98.P$2 U11.1(_:IN-)
N$100: R88.P$1 U17.2(AN)
N$102: Q9.G(G1) R87.P$2
N$103: R87.P$1 U17.6(VO) U17.7(VO)
N$105: J4.2 P8.H1(S) P8.H2(S) P8.H3(S) P8.H4(S) P8.H5(S) P8.H6(S) P8.H7(S) P8.H8(S) P8.H9(S) P8.H10(S) P8.H11(S) P8.H12(S) P8.PAD(S) Q9.D1 Q9.D2(D1) Q9.D3(D1) Q9.D4(D1)
PWM_UX1_H: R17.P$2 U4.1(VIA) ; also sheet 1
PWM_UX1_L: R18.P$2 U4.2(VIB) ; also sheet 1
PWM_VX2_H: R19.P$2 U5.1(VIA) ; also sheet 1
PWM_VX2_L: R20.P$2 U5.2(VIB) ; also sheet 1
PWM_WY1_H: R21.P$2 U6.1(VIA) ; also sheet 1
PWM_WY1_L: R22.P$2 U6.2(VIB) ; also sheet 1
PWM_Y2_H: R23.P$2 U7.1(VIA) ; also sheet 1
PWM_Y2_L: R24.P$2 U7.2(VIB) ; also sheet 1
UX1: C34.P$2 Q1.S1 Q1.S2(S1) Q1.S3(S1) Q1.S4(S1) Q1.S5(S1) Q2.D1 Q2.D2(D1) Q2.D3(D1) Q2.D4(D1) R9.1 R9.2 U4.14(GNDA)
VX2: C35.P$2 Q3.S1 Q3.S2(S1) Q3.S3(S1) Q3.S4(S1) Q3.S5(S1) Q4.D1 Q4.D2(D1) Q4.D3(D1) Q4.D4(D1) R10.1 R10.2 U5.14(GNDA)
WY1: C37.P$2 J3.3 P3.H1(S) P3.H2(S) P3.H3(S) P3.H4(S) P3.H5(S) P3.H6(S) P3.H7(S) P3.H8(S) P3.H9(S) P3.H10(S) P3.H11(S) P3.H12(S) P3.PAD(S) Q5.S1 Q5.S2(S1) Q5.S3(S1) Q5.S4(S1) Q5.S5(S1) Q6.D1 Q6.D2(D1) Q6.D3(D1) Q6.D4(D1) U6.14(GNDA)
Y2: C38.P$2 J3.4 P4.H1(S) P4.H2(S) P4.H3(S) P4.H4(S) P4.H5(S) P4.H6(S) P4.H7(S) P4.H8(S) P4.H9(S) P4.H10(S) P4.H11(S) P4.H12(S) P4.PAD(S) Q7.S1 Q7.S2(S1) Q7.S3(S1) Q7.S4(S1) Q7.S5(S1) Q8.D1 Q8.D2(D1) Q8.D3(D1) Q8.D4(D1) U7.14(GNDA)

### Notes on the sheet
- Power Stage

## Sheet 5 of 5: Interface
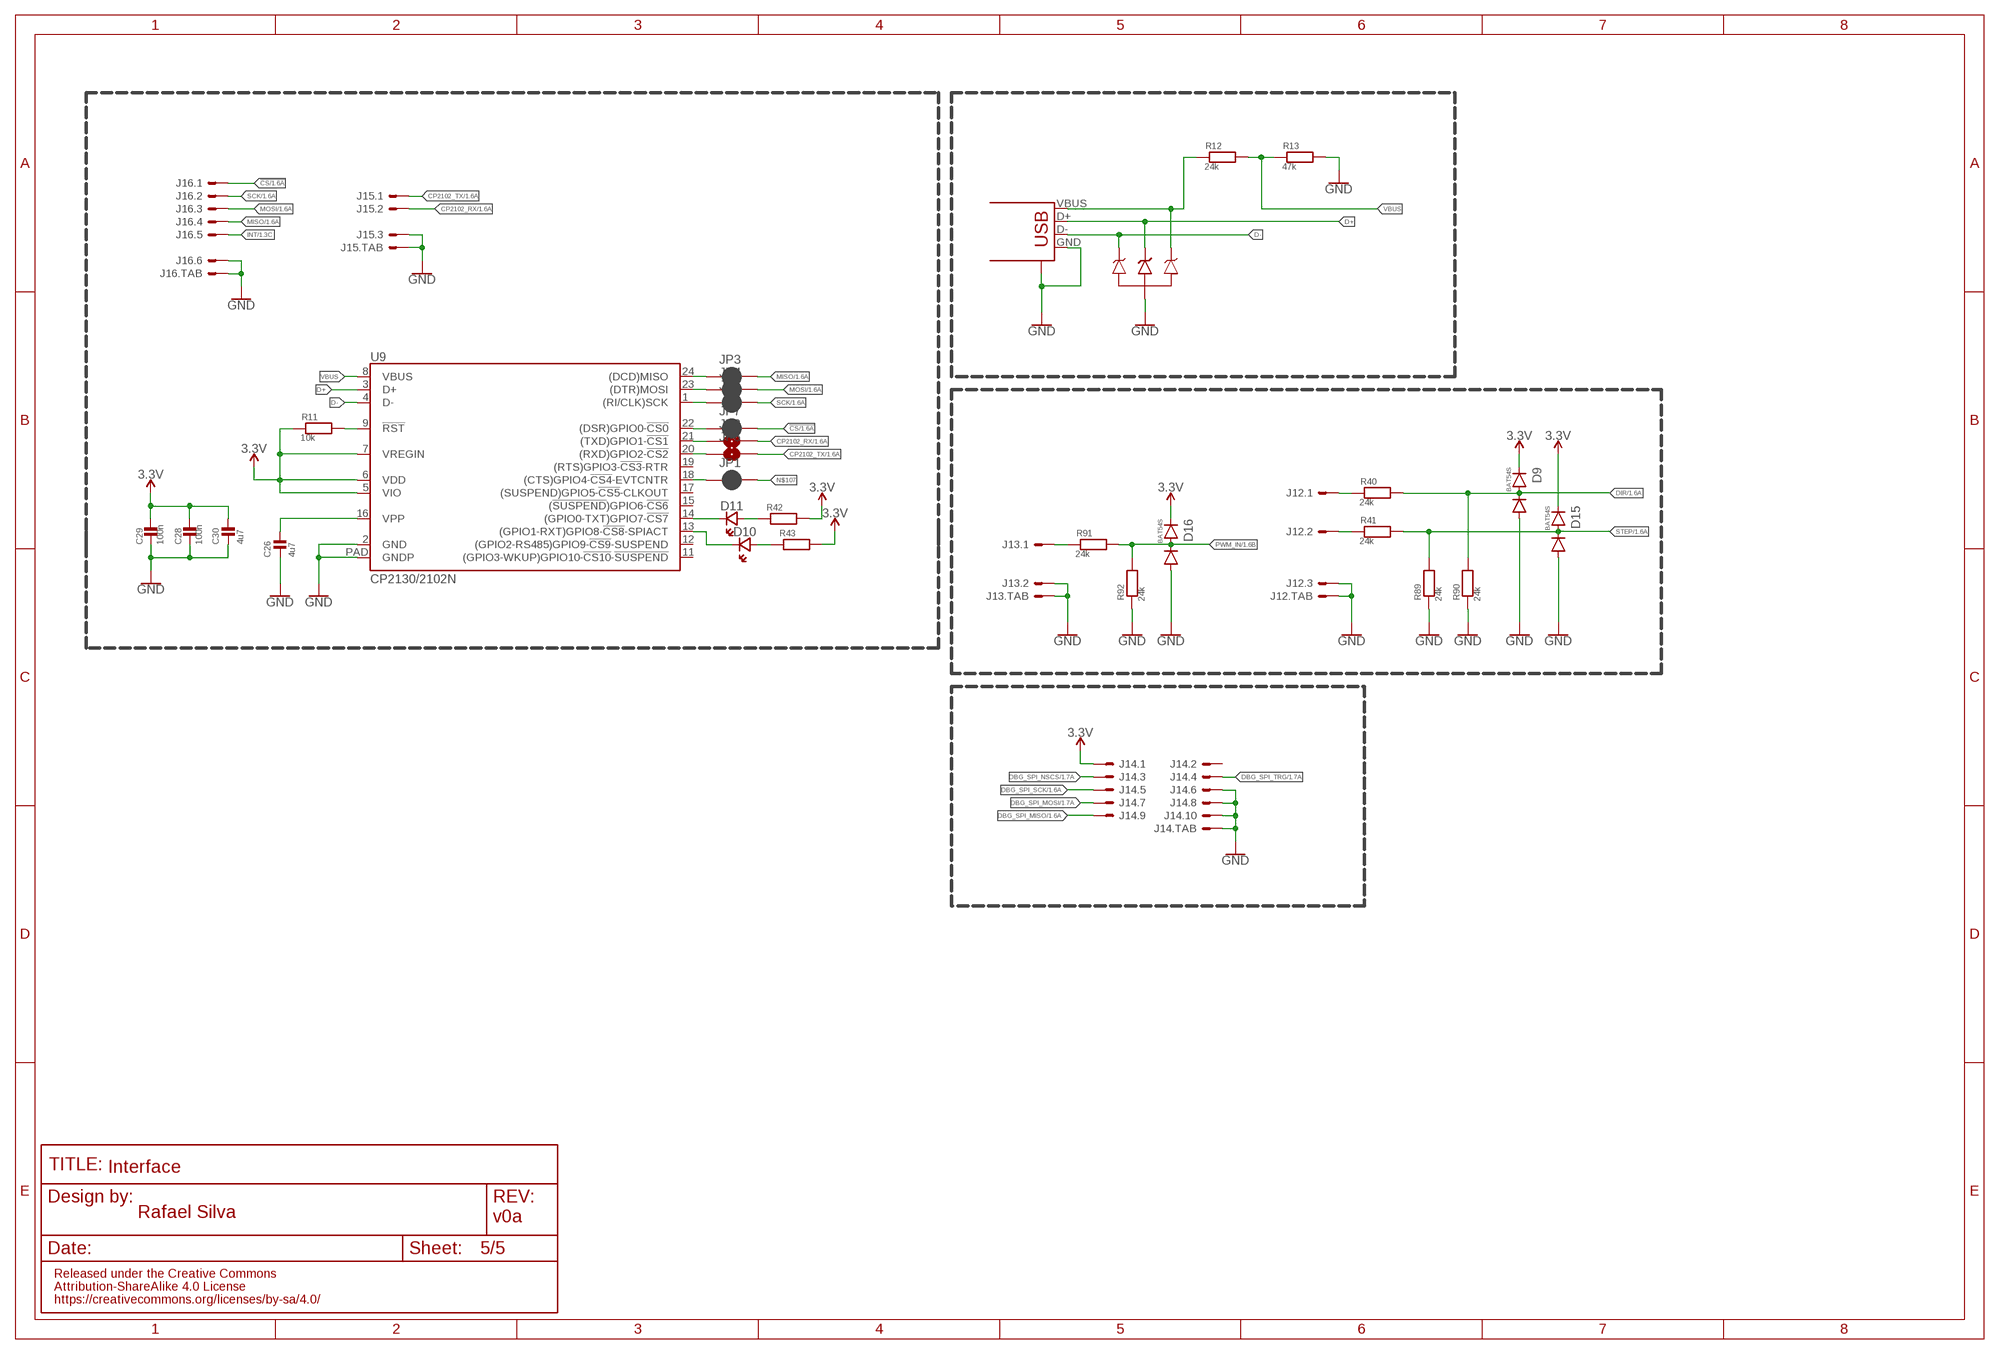
[diagram p4: schematic, sheet 5]

### Parts
C26  4u7  MLCC0603  [0603_WAVE]
C28  100n  MLCC0603  [0603_WAVE]
C29  100n  MLCC0603  [0603_WAVE]
C30  4u7  MLCC0603  [0603_WAVE]
D5  SP0503BAHT  [SOT143]
D9  BAT54S  [SOT-23-3]
D10  LED0603  [CHIPLED_0603]
D11  LED0603  [CHIPLED_0603]
D15  BAT54S  [SOT-23-3]
D16  BAT54S  [SOT-23-3]
J12  SH-3  [SM03B-SSR-H-TB]
J13  SH-2  [SM02B-SSR-H-TB]
J14  F20F-10DP-1V  [F20F-10DP-1V]
J15  SH-3  [SM03B-SSR-H-TB]
J16  SH-6  [SM06B-SSR-H-TB]
JP1  JUMPER-SMT_2_NC_PASTE_SILK  [SMT-JUMPER_2_NC_PASTE_SILK]
JP2  JUMPER-SMT_2_NO_SILK  [SMT-JUMPER_2_NO_SILK]
JP3  JUMPER-SMT_2_NC_PASTE_SILK  [SMT-JUMPER_2_NC_PASTE_SILK]
JP4  JUMPER-SMT_2_NC_PASTE_SILK  [SMT-JUMPER_2_NC_PASTE_SILK]
JP5  JUMPER-SMT_2_NC_PASTE_SILK  [SMT-JUMPER_2_NC_PASTE_SILK]
JP6  JUMPER-SMT_2_NO_SILK  [SMT-JUMPER_2_NO_SILK]
JP7  JUMPER-SMT_2_NC_PASTE_SILK  [SMT-JUMPER_2_NC_PASTE_SILK]
R11  10k  RESISTOR0603  [0603_WAVE]
R12  24k  RESISTOR0603  [0603_WAVE]
R13  47k  RESISTOR0603  [0603_WAVE]
R40  24k  RESISTOR0603  [0603_WAVE]
R41  24k  RESISTOR0603  [0603_WAVE]
R42  RESISTOR0603  [0603_WAVE]
R43  RESISTOR0603  [0603_WAVE]
R89  24k  RESISTOR0603  [0603_WAVE]
R90  24k  RESISTOR0603  [0603_WAVE]
R91  24k  RESISTOR0603  [0603_WAVE]
R92  24k  RESISTOR0603  [0603_WAVE]
U9  CP2130/2102N  [QFN24]
U$10  USB-SHIELD  [USB-M-S1]

### Nets
3.3V: C28.P$1 C29.P$1 C30.P$1 D9.P$2 D15.P$2 D16.P$2 J14.1 R11.P$1 R42.P$2 R43.P$2 U9.5(VIO) U9.6(VDD) U9.7(VREGIN) ; also sheet 1,2,3,4
!CS: J16.1 JP7.2 ; also sheet 1
CP2102_RX: J15.2 JP2.2 ; also sheet 1
CP2102_TX: J15.1 JP6.2 ; also sheet 1
D+: D5.3 U9.3(D+) U$10.D+
D-: D5.2 U9.4(D-) U$10.D-
DBG_SPI_MISO: J14.9 ; also sheet 1
DBG_SPI_MOSI: J14.7 ; also sheet 1
DBG_SPI_NSCS: J14.3 ; also sheet 1
DBG_SPI_SCK: J14.5 ; also sheet 1
DBG_SPI_TRG: J14.4 ; also sheet 1
DIR: D9.P$3 R40.P$2 R90.P$2 ; also sheet 1
GND: C26.P$2 C28.P$2 C29.P$2 C30.P$2 D5.1 D9.P$1 D15.P$1 D16.P$1 J12.3 J12.FIT@1 J12.FIT@2 J13.2 J13.FIT@1 J13.FIT@2 J14.6 J14.8 J14.10 J14.TAB1 J14.TAB2 J15.3 J15.FIT@1 J15.FIT@2 J16.6 J16.FIT@1 J16.FIT@2 R13.P$2 R89.P$1 R90.P$1 R92.P$1 U9.2(GND) U9.PAD(GNDP) U$10.GND U$10.GND@1(CASE) U$10.GND@2(CASE) U$10.GND@3(CASE) U$10.GND@4(CASE) ; also sheet 1,2,3,4
INT: J16.5 ; also sheet 1
MISO: J16.4 JP3.2 ; also sheet 1
MOSI: J16.3 JP4.2 ; also sheet 1
N$30: D5.4 R12.P$1 U$10.VBUS
N$33: J12.2 R41.P$1
N$34: R11.P$2 U9.9(!RST)
N$35: C26.P$1 U9.16(VPP)
N$59: J12.1 R40.P$1
N$61: J13.1 R91.P$1
N$63: D11.C(CA) U9.14((GPIO0-TXT)GPIO7-!CS7)
N$64: D10.C(CA) U9.13((GPIO1-RXT)GPIO8-!CS8!-SPIACT)
N$65: D11.A(AN) R42.P$1
N$66: D10.A(AN) R43.P$1
N$68: JP6.1 U9.20((RXD)GPIO2-!CS2)
N$101: JP2.1 U9.21((TXD)GPIO1-!CS1)
N$106: JP1.1 U9.18((CTS)GPIO4-!CS4!-EVTCNTR)
N$107: JP1.2
N$108: JP7.1 U9.22((DSR)GPIO0-!CS0)
N$109: JP5.1 U9.1((RI/CLK)SCK)
N$110: JP4.1 U9.23((DTR)MOSI)
N$111: JP3.1 U9.24((DCD)MISO)
PWM_IN: D16.P$3 R91.P$2 R92.P$2 ; also sheet 1
SCK: J16.2 JP5.2 ; also sheet 1
STEP: D15.P$3 R41.P$2 R89.P$2 ; also sheet 1
VBUS: R12.P$2 R13.P$1 U9.8(VBUS)
Unconnected: J14.2 U9.11((GPIO3-WKUP)GPIO10-!CS10!-!SUSPEND) U9.12((GPIO2-RS485)GPIO9-!CS9!-SUSPEND) U9.15((!SUSPEND!)GPIO6-!CS6) U9.17((SUSPEND)GPIO5-!CS5!-CLKOUT) U9.19((RTS)GPIO3-!CS3!-RTR)

### Notes on the sheet
- Interface

## Library data of the parts
C1-C17 C19 C21 C26-C59 C61-C64 C66-C71 C76-C107 = Passive Components > Capacitors > Multilayer Ceramic Capacitors MLCC:MLCC: KEMET’s X7R dielectric features a 125°C maximum operating temperature and is considered temperature stable. The Electronics Components, Assemblies and Materials Association (EIA) characterizes X7R dielectric as a Class II material. Components of this classification are fixed, ceramic dielectric capacitors suited for bypass and decoupling applications or for frequency discriminating circuits where Q and stability of capacitance characteristics are not critical. X7R exhibits a predictable change in capacitance with respect to time and voltage, boasting a minimal change in capacitance with reference to ambient temperature. Capacitance change is limited to ±15% from −55°C to +125°C.
C18 C20 C22-C25 = Passive Components > Capacitors > Aluminium Electrolytic Capacitors:CAPACITOR_EL
D1-D4 = Semiconductors > Discrete Semiconductors > Diodes & Rectifiers > Schottky Diodes & Rectifiers:DSK24
D5 = Circuit Protection > ESD Suppressors \ TVS Diodes:SP0503BAHT
D6 = Semiconductors > Discrete Semiconductors > Diodes & Rectifiers > Schottky Diodes & Rectifiers:SK54L
D8 D9 D12-D16 = Semiconductors > Discrete Semiconductors > Diodes & Rectifiers > Schottky Diodes & Rectifiers:BAT54S
D10 D11 D17-D19 = Opto-electronics > LED Emitters:LED: LED 0603 - 0603 Surface Mount Package 2mA: Green LED - Low Power (3.9mcd, 2ma, 1.7Vf) - Digikey: 475-2709-2-ND Orange LED - Low Power (9.8mcd, 2ma, 1.8Vf) - Digikey: 475-1194-2-ND Red LED - Low Power (5mcd, 2ma, 1.8Vf) - Digikey: 475-1195-2-ND Yellow LED - Low Power (7mcd, 2ma, 1.8Vf) - Digikey: 475-1196-2-ND 5mA: Blue LED - Low Power (17mcd, 5ma, 2.9Vf) - Digikey: LNJ937W8CRACT-ND 0805 - 0805 Surface Mount Package 2mA: Red LED (8.8mcd, 2mA, 1.8Vf, Clear) - Low Power [Digikey: 475-2510-1-ND] Green LED (5mcd, 2mA, 1.8Vf, Clear) - Low Power [Digikey: 475-2730-1-ND] Yellow LED (11.3mcd, 2mA, 1.8Vf, Clear) - Low Power [Digikey: 475-2555-1-ND] 20mA: Red LED (104mcd, 20mA, Diffused) - LS R976 [Digikey: 475-1278-6-ND] Red LED (12mcd, 20mA, 2.0Vf, Clear) - APT2012EC [Digikey: 754-1128-1-ND] Green LED (15mcd, 20mA, 2.2Vf, Clear) - APT2012GC [Digikey: 754-1131-1-ND] Orange LED (160mcd, 20mA, 2.1Vf, Clear) - APT2012SECK [Digikey: 754-1130-1-ND] 1206 - 1206 Surface Mount Package Green LED (26mcd, 20mA, Diffused) - LG N971 [Digikey: 475-1407-6-ND] Red LED (15mcd, 20mA, Diffused) - LH N974 [Digikey: 475-1416-6-ND] Cree - Cree High-Power Surface Mount LEDs XPEBWT-L1-0000-00D50 - White 111lm 350mA 2.9Vf 6200K 110° XTEAWT-00-0000-00000LEE3 - White 114lm 350mA 2.85Vf 5000K 115° Everlight - Everlight 45-21 Series Surface Mount LEDs 45-21/QK2C-B2832AC2CB2/2T - Warm White 2000mcd 20mA 3.25Vf 3050K 120° 45-21/LK2C-B38452C4CB2/2T - Nuetral White 2000mcd 20mA 3.25Vf 4150K 120° 45-21/LK2C-B50634C6CB2/2T - Cold White 2200mcd 20mA 3.25Vf 5650K 120° PLCC2 Reverse Mount LS T77K-J1L2-1-0-2-R18-Z - Red 11.25mcd 2mA 1.8Vf 630nm 120° LO T77K-L1M2-24-Z - Orange 19.6mcd 2mA 1.8Vf 606nm 120° LY T77K-K2M1-26-Z - Yellow 15.7mcd 2mA 1.8Vf 587nm 120°
J1 J2 J4 = Connectors > Other:2P-6.35P
J3 = Connectors > Other:4P-6.35P
J5-J8 J10 = Connectors > JST > SH:SH-5
J9 J13 = Connectors > JST > SH:SH-2
J12 J15 = Connectors > JST > SH:SH-3
J14 = Connectors > Other:F20F-10DP-1V
J16 = Connectors > JST > SH:SH-6
JP1 JP3-JP5 JP7 = Utility > Board:JUMPER-SMT_2_NC_PASTE: Normally closed solder jumper This jumper has an aperture in the stencil to allow solder paste to bridge the split in the wire so it's normally closed (NC). Wick off the solder to open the connection. Reapply solder to reclose the connection.
JP2 JP6 = Utility > Board:JUMPER-SMT_2_NO: Normally open jumper This jumper has two pads in close proximity to each other. Apply solder to close the connection. Round pads are easier to solder for beginners, but are a lot larger. SparkFun Product that uses the round pads: SparkFun EL Sequencer
L2 = Passive Components > Inductors, Chokes & Coils:INDUCTOR
P1-P8 = Connectors > Other:POWPAD
Q1-Q9 = Semiconductors > Discrete Semiconductors > Transistors > MOSFETs:IRF7580
R1-R8 R11-R13 R15-R43 R45 R46 R48-R99 = Passive Components > Resistors > Chip Resistors:RESISTOR: Resistors For new designs, use the packages preceded by an '_' character since they are more reliable: The following footprints should be used on most boards: _0402 - Standard footprint for regular board layouts _0603 - Standard footprint for regular board layouts _0805 - Standard footprint for regular board layouts _1206 - Standard footprint for regular board layouts For extremely tight-pitch boards where space is at a premium, the following 'micro-pitch' footprints can be used (smaller pads, no silkscreen outline, etc.): _0402MP - Micro-pitch footprint for very dense/compact boards _0603MP - Micro-pitch footprint for very dense/compact boards _0805MP - Micro-pitch footprint for very dense/compact boards _1206MP - Micro-pitch footprint for very dense/compact boards
R9 R10 = Passive Components > Resistors > Current Sense:LRMAP3920
R47 = Passive Components > Thermistors > NTC:NTC: Resistors For new designs, use the packages preceded by an '_' character since they are more reliable: The following footprints should be used on most boards: _0402 - Standard footprint for regular board layouts _0603 - Standard footprint for regular board layouts _0805 - Standard footprint for regular board layouts _1206 - Standard footprint for regular board layouts For extremely tight-pitch boards where space is at a premium, the following 'micro-pitch' footprints can be used (smaller pads, no silkscreen outline, etc.): _0402MP - Micro-pitch footprint for very dense/compact boards _0603MP - Micro-pitch footprint for very dense/compact boards _0805MP - Micro-pitch footprint for very dense/compact boards _1206MP - Micro-pitch footprint for very dense/compact boards
U1 = Power > Motor\Motion\Ignition Controllers & Drivers:TMC4671: The TMC4671 is a fully integrated servo controller, providing Field Oriented Control for BLDC/PMSM and 2-phase Stepper Motors as well as DC motors and voice coils. All control functions are implemented in hardware. Integrated ADCs, position sensor interfaces, position interpolators, enable a fully functional servo controller for a wide range of servo applications.
U2 U3 = Power > LDO Voltage Regulators:MIC39101: IC, LDO VOLT REG, 3.3V, 0.3A,
U4-U7 = Power > Gate Drivers:SI82397
U8 = Power > Switching Controllers:MIC4682
U9 = Semiconductors > Integrated Circuits - ICs > Interface ICs > USB Interface IC:CP2130/2102N
U10 U11 = Semiconductors > Integrated Circuits - ICs > Amplifier ICs > Current Sense Amplifiers:AD8418A
U12 = Eletromechanical > MEMS Oscillators:DSC1101
U13-U16 = Semiconductors > Integrated Circuits - ICs > Logic ICs > Logic Gates:74LVC3G17
U17 = Power > Gate Drivers:SI8261
U18-U21 = Circuit Protection > ESD Suppressors \ TVS Diodes:SRV05-4
U$10 = Connectors > USB:USB-SHIELD
U$12 U$13 U$15 U$16 = Utility > Board:MOUNTINGHOLE: Mounting Hole For #2 screws (0.086"/2.18mm width, 0.094"/2.4mm hole) use 2.5mm; BOM: EXCLUDE